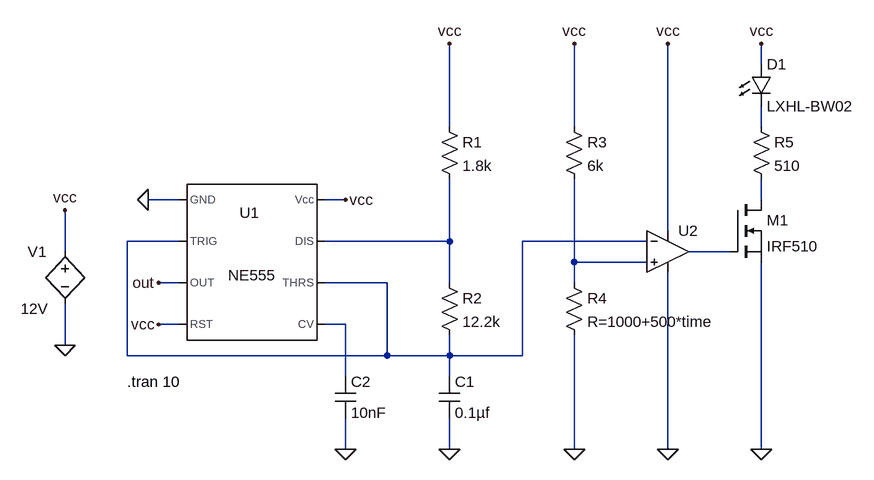
[diagram p0: schematic esc_ne555.asc]
esc_ne555.asc, the LTspice schematic file:
Version 4
SHEET 1 1140 680
WIRE 976 -464 976 -496
WIRE 496 -368 496 -496
WIRE 688 -368 688 -496
WIRE 976 -368 976 -400
WIRE 80 -256 32 -256
WIRE 336 -256 304 -256
WIRE 976 -256 976 -288
WIRE 832 -208 832 -496
WIRE 80 -192 0 -192
WIRE 496 -192 496 -288
WIRE 496 -192 304 -192
WIRE 800 -192 608 -192
WIRE -96 -176 -96 -240
WIRE 928 -176 864 -176
WIRE 688 -160 688 -288
WIRE 800 -160 688 -160
WIRE 80 -128 48 -128
WIRE 400 -128 304 -128
WIRE 496 -128 496 -192
WIRE 688 -128 688 -160
WIRE 80 -64 48 -64
WIRE 336 -64 304 -64
WIRE -96 -32 -96 -96
WIRE 0 -16 0 -192
WIRE 400 -16 400 -128
WIRE 400 -16 0 -16
WIRE 496 -16 496 -48
WIRE 496 -16 400 -16
WIRE 608 -16 608 -192
WIRE 608 -16 496 -16
WIRE 336 16 336 -64
WIRE 496 16 496 -16
WIRE 336 128 336 80
WIRE 496 128 496 80
WIRE 688 128 688 -48
WIRE 832 128 832 -144
WIRE 976 128 976 -160
FLAG 496 128 0
FLAG 688 128 0
FLAG 32 -256 0
FLAG 336 128 0
FLAG -96 -32 0
FLAG 832 128 0
FLAG 976 128 0
FLAG -96 -240 vcc
FLAG 336 -256 vcc
FLAG 496 -496 vcc
FLAG 688 -496 vcc
FLAG 832 -496 vcc
FLAG 976 -496 vcc
FLAG 48 -64 vcc
FLAG 48 -128 out
SYMBOL Misc\\NE555 192 -160 R0
WINDOW 0 -4 -76 Center 2
SYMATTR InstName U1
SYMBOL res 480 -384 R0
SYMATTR InstName R1
SYMATTR Value 1.8k
SYMBOL res 480 -144 R0
SYMATTR InstName R2
SYMATTR Value 12.2k
SYMBOL cap 480 16 R0
SYMATTR InstName C1
SYMATTR Value 0.1µf
SYMBOL res 672 -384 R0
SYMATTR InstName R3
SYMATTR Value 6k
SYMBOL res 672 -144 R0
SYMATTR InstName R4
SYMATTR Value R=1000+500*time
SYMBOL cap 320 16 R0
SYMATTR InstName C2
SYMATTR Value 10nF
SYMBOL nmos 928 -256 R0
SYMATTR InstName M1
SYMATTR Value IRF510
SYMBOL bv -96 -192 R0
WINDOW 0 -57 16 Left 2
WINDOW 3 -68 104 Left 2
SYMATTR InstName V1
SYMATTR Value 12V
SYMATTR Prefix V
SYMBOL Opamps\\UniversalOpamp2 832 -176 R0
SYMATTR InstName U2
SYMBOL LED 960 -464 R0
SYMATTR InstName D1
SYMATTR Value LXHL-BW02
SYMATTR Description Diode
SYMATTR Type diode
SYMBOL res 960 -384 R0
SYMATTR InstName R5
SYMATTR Value 510
TEXT 0 24 Left 2 !.tran 10

The netlist it stands for:
* esc_ne555.asc
XU1 0 N003 out vcc N007 N003 N004 vcc NE555  ; pins GND TRIG OUT RST CV THRS DIS Vcc
R1 vcc N004 1.8k
R2 N004 N003 12.2k
C1 N003 0 0.1µf
R3 vcc N006 6k
R4 N006 0 R=1000+500*time
C2 N007 0 10nF
M1 N002 N005 0 0 IRF510
V1 vcc 0 12V
XU2 N006 N003 vcc 0 N005 level.2 Avol=1Meg GBW=10Meg Slew=10Meg ilimit=25m rail=0 Vos=0 phimargin=45 en=0 enk=0 in=0 ink=0 Rin=500Meg  ; pins IN+ IN- V+ V- OUT
D1 vcc N001 LXHL-BW02
R5 N001 N002 510
.model D D
.lib standard.dio
.model NMOS NMOS
.model PMOS PMOS
.lib standard.mos
.tran 10
.lib NE555.sub
.lib UniversalOpamps2.sub
.backanno
.end